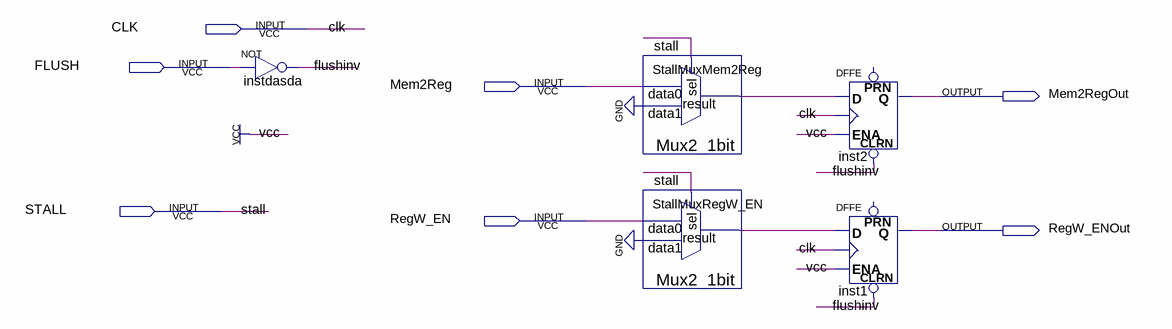
[diagram p0: schematic sheet]
// Quartus schematic WBPipe.bdf as structural Verilog: 5 symbols, 7 pins
module WBPipe (
  input  CLK,
  input  FLUSH,
  input  Mem2Reg,
  input  STALL,
  input  RegW_EN,
  output Mem2RegOut,
  output RegW_ENOut
);

  wire flushinv, StallMuxMem2Reg_result, StallMuxRegW_EN_result;

  not instdasda (flushinv, FLUSH);
  Mux2_1bit StallMuxMem2Reg (.data1(1'b0), .data0(Mem2Reg), .sel(STALL), .result(StallMuxMem2Reg_result));
  Mux2_1bit StallMuxRegW_EN (.data1(1'b0), .data0(RegW_EN), .sel(STALL), .result(StallMuxRegW_EN_result));
  DFFE inst2 (.CLRN(flushinv), .D(StallMuxMem2Reg_result), .CLK(CLK), .ENA(1'b1), .Q(Mem2RegOut));  // open: PRN
  DFFE inst1 (.CLRN(flushinv), .D(StallMuxRegW_EN_result), .CLK(CLK), .ENA(1'b1), .Q(RegW_ENOut));  // open: PRN
endmodule
